# EAGLE design sense_pcb_b (EAGLE 9.6.2)
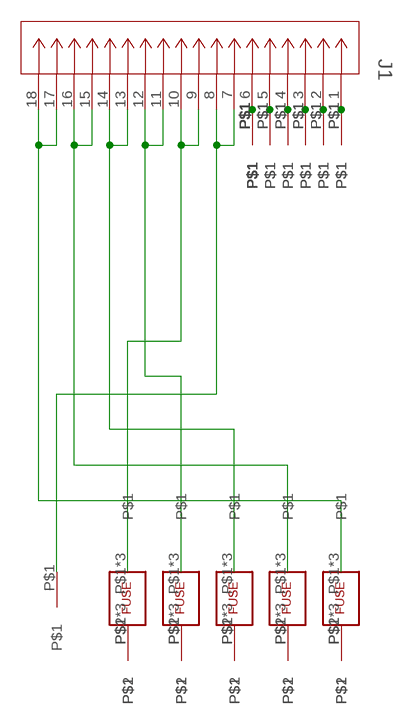
[diagram p0: schematic, sheet 1]

## Parts
J1  DF11-18DP-2DSA(24)  [CON18_2X9_UF_DF11_HIR]
U$1  FUSE  [FUSE_PADS]
U$2  FUSE  [FUSE_PADS]
U$3  FUSE  [FUSE_PADS]
U$4  FUSE  [FUSE_PADS]
U$5  FUSE  [FUSE_PADS]
U$6  BB_CONTACT  [BB_CONTACT]
U$7  BB_CONTACT  [BB_CONTACT]
U$8  BB_CONTACT  [BB_CONTACT]
U$9  BB_CONTACT  [BB_CONTACT]
U$10  BB_CONTACT  [BB_CONTACT]
U$11  BB_CONTACT  [BB_CONTACT]
U$12  THERM_PIN  [THERM_PIN]
U$13  THERM_PIN  [THERM_PIN]
U$14  THERM_PIN  [THERM_PIN]
U$15  THERM_PIN  [THERM_PIN]
U$16  THERM_PIN  [THERM_PIN]
U$17  THERM_PIN  [THERM_PIN]
U$18  THERM_PIN  [THERM_PIN]
U$19  THERM_PIN  [THERM_PIN]
U$20  THERM_PIN  [THERM_PIN]
U$21  THERM_PIN  [THERM_PIN]
U$22  THERM_PIN  [THERM_PIN]
U$23  THERM_PIN  [THERM_PIN]
U$24  THERM_PIN  [THERM_PIN]
U$25  THERM_PIN  [THERM_PIN]
U$26  THERM_PIN  [THERM_PIN]
U$27  THERM_PIN  [THERM_PIN]
U$28  THERM_PIN  [THERM_PIN]
U$29  THERM_PIN  [THERM_PIN]
U$30  THERM_PIN  [THERM_PIN]
U$31  THERM_PIN  [THERM_PIN]

## Nets
N$1: J1.7 J1.8 U$11.P$1
N$2: U$1.P$2 U$1.P$4 U$1.P$6 U$6.P$1
N$3: J1.17 J1.18 U$5.P$1 U$5.P$3 U$5.P$5
N$4: U$2.P$2 U$2.P$4 U$2.P$6 U$7.P$1
N$5: U$5.P$2 U$5.P$4 U$5.P$6 U$10.P$1
N$6: U$3.P$2 U$3.P$4 U$3.P$6 U$8.P$1
N$7: J1.15 J1.16 U$4.P$1 U$4.P$3 U$4.P$5
N$8: U$4.P$2 U$4.P$4 U$4.P$6 U$9.P$1
N$9: J1.13 J1.14 U$3.P$1 U$3.P$3 U$3.P$5
N$10: J1.11 J1.12 U$2.P$1 U$2.P$3 U$2.P$5
N$11: J1.9 J1.10 U$1.P$1 U$1.P$3 U$1.P$5
THERM1: J1.5 U$22.P$1 U$23.P$1
THERM2: J1.4 U$24.P$1 U$25.P$1
THERM3: J1.3 U$26.P$1 U$27.P$1
THERM4: J1.2 U$28.P$1 U$29.P$1
THERM5: J1.1 U$30.P$1 U$31.P$1
THERMGND: J1.6 U$12.P$1 U$13.P$1 U$14.P$1 U$15.P$1 U$16.P$1 U$17.P$1 U$18.P$1 U$19.P$1 U$20.P$1 U$21.P$1

## Library data of the parts
J1 = sense_pcb_components:DF11-18DP-2DSA(24); COPYRIGHT: Copyright (C) 2023 Ultra Librarian. All rights reserved.; MANUFACTURER_PART_NUMBER: DF11-18DP-2DSA(24); MFR_NAME: Hirose
U$1-U$5 = sense_pcb_components:FUSE
U$6-U$11 = sense_pcb_components:BB_CONTACT
U$12-U$31 = sense_pcb_components:THERM_PIN

## Board
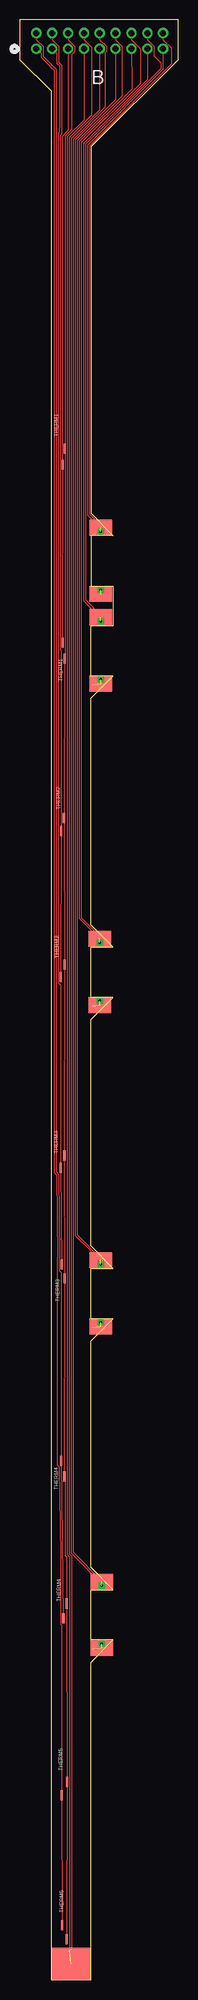
[diagram p1: board, top side]
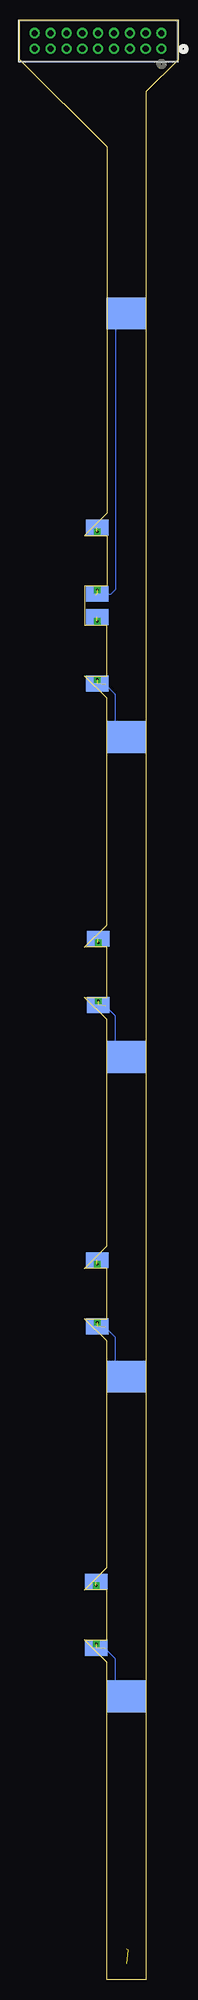
[diagram p2: board, bottom side, seen from below]

Size 20 x 247 mm. Coordinates in mm from the lower left corner, seen from the top.
Outline: 9,83.3 9,89.65 11.8,89.65 9,92.45 9,121 11.8,123.8 9,123.8 9,130.15 11.8,130.15 9,132.95 9,161.5 11.8,164.3 9,164.3 9,170.65 11.8,170.65 11.8,175.65 9,175.65 9,182 11.8,182 9,184.8 9,231 20,242 20,247 0,247 0,242 4,238 4,0 9,0 9,40 11.8,42.8 9,42.8 9,49.15 11.8,49.15 9,51.95 9,80.5 11.8,83.3 9,83.3
Copper layers (1*16): Top 0.035mm / dielectric 1.5mm / Bottom 0.035mm
Design rules "small_traces": minimum track width 5mil, minimum drill 0.2mm, track to track 5mil, track to pad 5mil, pad to pad 5mil, via to via 5mil, smd to smd 5mil, copper to edge 6mil, drill to drill 6mil, minimum pad ring 10mil, minimum via ring 0.13mm, stop-mask expansion 4mil, vias tented up to drill 0mil, thermal gap 10mil

### Footprints (pad centres in the part's own frame; a part is rotated, then mirrored left to right if it is on the bottom)
CON18_2X9_UF_DF11_HIR = drill 0.762 pad 1.27: 1 0,0; 2 0,2.007; 3 -2.007,0; 4 -2.007,2.007; 5 -3.988,0; 6 -3.988,2.007; 7 -5.994,0; 8 -5.994,2.007; 9 -8.001,0; 10 -8.001,2.007; 11 -10.008,0; 12 -10.008,2.007; 13 -11.989,0; 14 -11.989,2.007; 15 -13.995,0; 16 -13.995,2.007; 17 -16.002,0; 18 -16.002,2.007
FUSE_PADS = smd 2.8 x 2 bottom: P$1 0,0; P$2 0,8.35 | smd 2.8 x 2: P$3 0,0; P$4 0,8.35 | drill 0.305 square: P$5 0,0.508; P$6 0,7.842
BB_CONTACT = smd 5 x 4: P$1 0,0
THERM_PIN = smd 0.279 x 1.27: P$1 0,0

### Placement (x,y rotation side)
J1  2.09,243.33 0 bottom
U$1  10.35,50.16 180 top
U$2  10.22,90.68 180 top
U$3  10.1,131.19 180 top
U$4  10.22,171.7 180 top
U$5  10.22,183.01 180 top
U$6  6.54,35.7 0 bottom
U$7  6.54,76 0 bottom
U$8  6.54,116.3 0 bottom
U$9  6.54,156.6 0 bottom
U$10  6.54,210 0 bottom
U$11  6.49,2.01 0 top
U$12  5.65,192.94 0 top
U$13  5.65,166.5 0 top
U$14  5.57,146.38 0 top
U$15  5.65,127.97 0 top
U$16  5.63,103.86 0 top
U$17  5.65,88.37 0 top
U$18  5.63,63.42 0 top
U$19  5.91,47.4 0 top
U$20  5.96,24.94 0 top
U$21  5.91,5.11 0 top
U$22  5.4,190.96 0 top
U$23  5.4,168.5 0 top
U$24  5.17,126.39 0 top
U$25  5.22,144.75 0 top
U$26  5.14,102.31 0 top
U$27  5.27,90.12 0 top
U$28  5.22,65.41 0 top
U$29  5.5,45.52 0 top
U$30  5.27,23.22 0 top
U$31  5.35,6.86 0 top

### Tracks (layer width: path | path; a pad name or v marks a point on that pad's centre or on a via)
N$1  (2 unrouted)
  Top 0.127: J1.8 8.09,244.5 9.07,243.52 9.07,234.96 6.23,232.13 6.23,53.69 6.54,53.39 6.54,3.81 | J1.7 8.09,234.35 5.98,232.24 5.98,53.59 6.29,53.28 6.29,3.73
N$2  (3 unrouted)
  Bottom 0.152: 9.16,41.71 7.91,40.45 7.91,37.07 U$6.P$1
N$3  (2 unrouted)
  Top 0.127: J1.18 18.1,244.5 19.12,243.48 19.12,241.42 8.78,231.09 8.78,184.71 10.22,183.27 U$5.P$5 8.94,184.2 8.53,184.6 8.53,231.19 18.1,240.76 J1.17
N$4  (3 unrouted)
  Bottom 0.152: 9.16,82.21 7.91,80.95 7.91,77.37 U$7.P$1
N$5  (3 unrouted)
  Bottom 0.152: 10.22,174.56 8.55,174.56 7.91,175.2 7.91,208.63 U$10.P$1 | 10.35,174.56 10.22,174.56 | 10.22,174.56 10.35,173.99
N$6  (3 unrouted)
  Bottom 0.152: 9.16,122.71 7.91,121.45 7.91,117.67 U$8.P$1
N$7  (2 unrouted)
  Top 0.127: J1.16 16.09,244.5 16.92,243.67 16.92,242.5 17.84,241.57 17.84,240.87 8.28,231.3 8.28,173.94 10.22,171.99 U$4.P$5 8.9,172.95 | J1.15 16.09,239.47 8.02,231.41 8.02,173.83 8.9,172.95 | 8.9,172.95 8.9,172.89
N$8  (3 unrouted)
  Bottom 0.152: 9.16,163.21 7.91,161.95 7.91,157.97 U$9.P$1
N$9  (2 unrouted)
  Top 0.127: J1.14 14.08,244.5 15.22,243.36 15.22,238.97 7.77,231.51 7.77,133.88 10.1,131.55 U$3.P$5 8.88,132.41 7.51,133.77 7.51,229.56 7.5,229.56 7.51,229.57 7.51,231.62 14.16,238.26 14.16,238.76 J1.13
N$10  (2 unrouted)
  Top 0.127: J1.12 12.1,244.5 12.93,243.67 12.93,242.99 12.89,242.95 12.89,237.35 7.25,231.71 7.25,93.89 10.22,90.92 U$2.P$5 8.78,92 7,93.79 7,231.82 12.1,236.92 J1.11
N$11  (2 unrouted)
  Top 0.127: J1.10 10.1,244.5 10.92,243.67 10.92,242.99 10.78,242.85 10.78,235.96 6.74,231.92 6.74,53.9 10.35,50.29 U$1.P$5 8.52,51.76 6.49,53.8 6.49,232.03 10.1,235.63 J1.9
THERM1
  Top 0.127: J1.5 6.08,233.06 5.32,232.3 5.32,191.03 U$22.P$1 5.37,168.53 U$23.P$1
THERM2
  Top 0.127: J1.4 4.1,244.5 4.93,243.67 4.93,241.64 5.27,241.3 5.27,232.6 5.07,232.4 5.07,167.69 5.22,167.54 U$25.P$1 U$24.P$1
THERM3
  Top 0.127: U$27.P$1 U$26.P$1 5.14,125.37 4.81,125.7 4.81,232.51 4.89,232.58 5.02,233.68 5.02,241.19 4.67,241.54 4.67,242.76 J1.3
THERM4
  Top 0.127: 4,241.3 3.99,241.31 | J1.2 2.09,244.5 2.92,243.67 2.92,242.39 3.99,241.31 | 3.99,241.31 4.56,240.75 4.56,101.85 4.9,101.51 5.01,90.9 4.94,90.83 4.94,89.41 5.22,89.13 U$28.P$1 U$29.P$1
THERM5
  Top 0.127: J1.1 2.67,242.76 2.67,242.28 3.75,241.2 3.75,241.18 3.83,241.1 4.3,240.63 4.3,101.75 4.64,101.41 4.75,91 4.69,90.94 4.69,64.89 4.98,64.6 5.13,53.5 5.17,45.58 5.17,44.8 5.27,44.7 U$30.P$1 U$31.P$1
THERMGND
  Top 0.127: J1.6 6.08,244.5 6.91,243.67 6.91,242.99 6.54,242.62 6.54,233.16 5.73,232.34 5.73,193.01 U$12.P$1 5.73,192.86 5.73,166.57 U$13.P$1 U$14.P$1 U$15.P$1 U$16.P$1 U$17.P$1 U$18.P$1 5.73,63.32 5.73,53.48 5.91,53.3 U$19.P$1 U$20.P$1 U$21.P$1

### Text on the board
tPlace: B | THERM1 | THERM1 | THERM2 | THERM2 | THERM3 | THERM3 | THERM4 | THERM4 | THERM5 | THERM5